# Altium project Mechalino_Second_Layer.PrjPcb
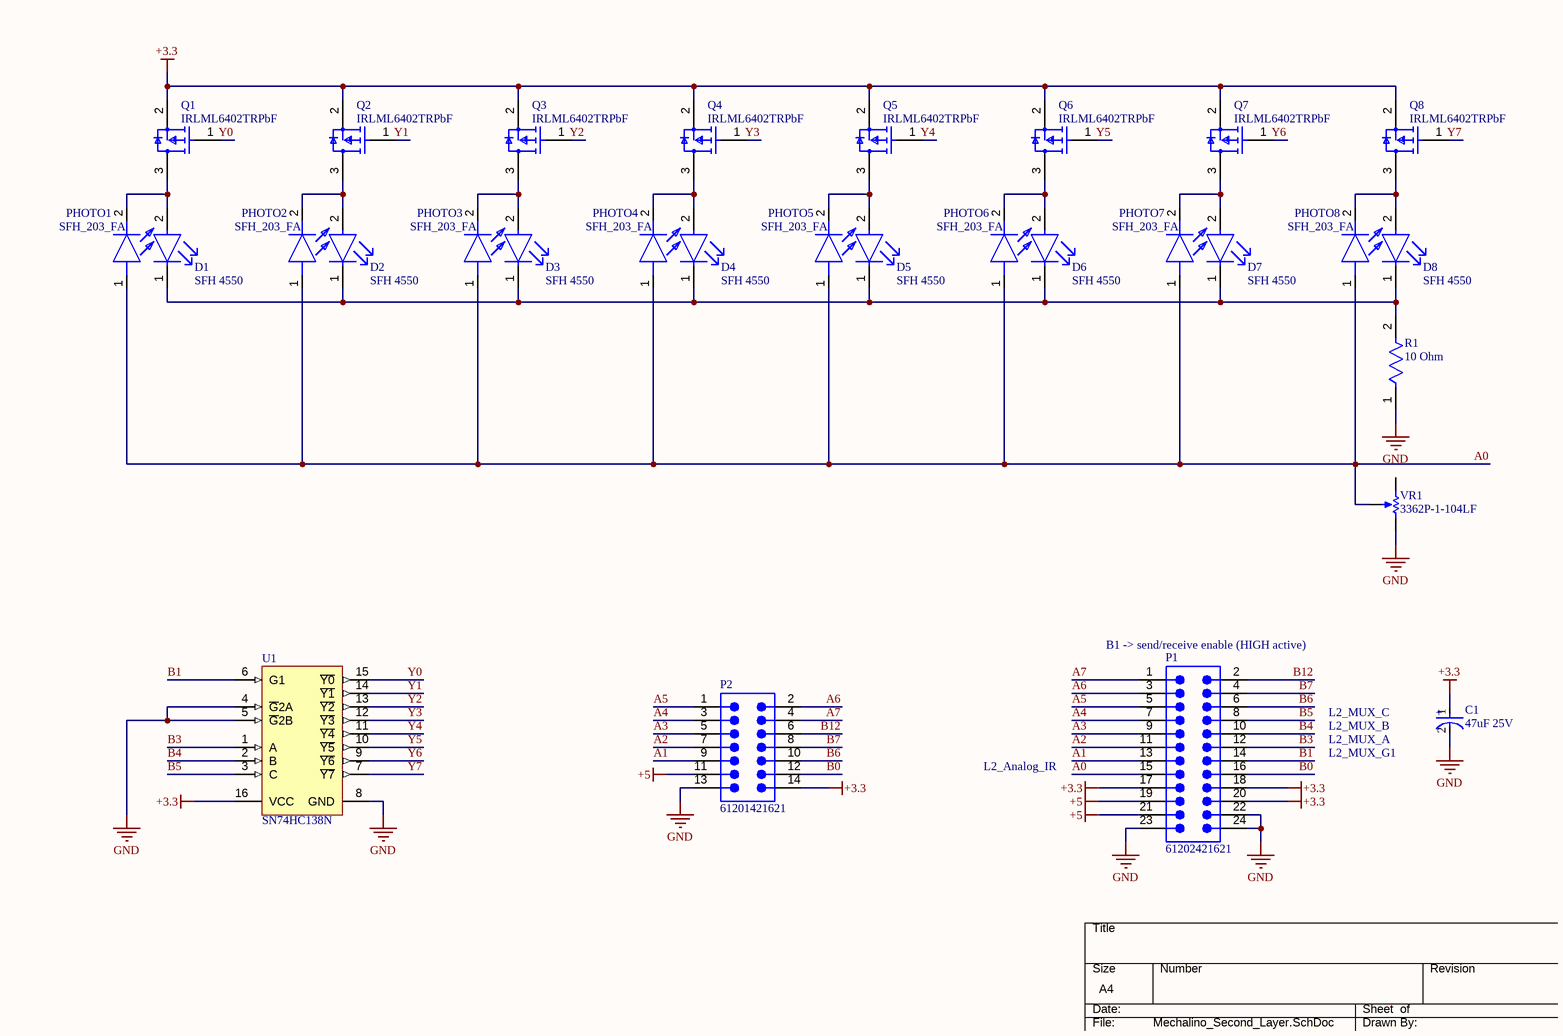
[diagram p0: Mechalino_Second_Layer.SchDoc]
1 sheet, 30 parts. Net scope: global (net labels, ports and power ports of the same name join across sheets).
Board file: Mechalino_Second_Layer.PcbDoc

## Sheet Mechalino_Second_Layer.SchDoc: Mechalino Second Layer
size A4; Author: Luka Kravos; CompanyName: AAU; DrawnBy: Luka Kravos; Engineer: Luka Kravos; Organization: NES, SmartGrids; Address1: Lakeside 10A; Address2: AAU Klagenfurt; SheetNumber: 1; SheetTotal: 1

### Parts
C1  47uF 25V  [FP-FKD-MFG]
D1  SFH 4550  [FP-SFH_4550-MFG]
D2  SFH 4550  [FP-SFH_4550-MFG]
D3  SFH 4550  [FP-SFH_4550-MFG]
D4  SFH 4550  [FP-SFH_4550-MFG]
D5  SFH 4550  [FP-SFH_4550-MFG]
D6  SFH 4550  [FP-SFH_4550-MFG]
D7  SFH 4550  [FP-SFH_4550-MFG]
D8  SFH 4550  [FP-SFH_4550-MFG]
P1  61202421621  [61202421621]
P2  61201421621  [61201421621]
PHOTO1  SFH_203_FA  [SFH203FA]
PHOTO2  SFH_203_FA  [SFH203FA]
PHOTO3  SFH_203_FA  [SFH203FA]
PHOTO4  SFH_203_FA  [SFH203FA]
PHOTO5  SFH_203_FA  [SFH203FA]
PHOTO6  SFH_203_FA  [SFH203FA]
PHOTO7  SFH_203_FA  [SFH203FA]
PHOTO8  SFH_203_FA  [SFH203FA]
Q1  IRLML6402TRPbF  [FP-Micro3-MFG]
Q2  IRLML6402TRPbF  [FP-Micro3-MFG]
Q3  IRLML6402TRPbF  [FP-Micro3-MFG]
Q4  IRLML6402TRPbF  [FP-Micro3-MFG]
Q5  IRLML6402TRPbF  [FP-Micro3-MFG]
Q6  IRLML6402TRPbF  [FP-Micro3-MFG]
Q7  IRLML6402TRPbF  [FP-Micro3-MFG]
Q8  IRLML6402TRPbF  [FP-Micro3-MFG]
R1  10 Ohm  [FP-ESR25-IPC_B]
U1  SN74HC138N  [N0016A]
VR1  3362P-1-104LF  [BOUR-3362P]

### Nets
+3.3: C1.1(C) P1.17 P1.18 P1.20 P2.14 Q1.2(S) Q2.2(S) Q3.2(S) Q4.2(S) Q5.2(S) Q6.2(S) Q7.2(S) Q8.2(S) U1.16(VCC)
+5: P1.19 P1.21 P2.11
GND: C1.2(A) P1.22 P1.23 P1.24 P2.13 R1.1 U1.4(~{G}2A) U1.5(~{G}2B) U1.8(GND) VR1.3(CW)
A0: P1.15 PHOTO1.1(A) PHOTO2.1(A) PHOTO3.1(A) PHOTO4.1(A) PHOTO5.1(A) PHOTO6.1(A) PHOTO7.1(A) PHOTO8.1(A) VR1.2(S)
A1: P1.13 P2.9
A2: P1.11 P2.7
A3: P1.9 P2.5
A4: P1.7 P2.3
A5: P1.5 P2.1
A6: P1.3 P2.2
A7: P1.1 P2.4
B0: P1.16 P2.12
B1: P1.14 U1.6(G1)
B3: P1.12 U1.1(A)
B4: P1.10 U1.2(B)
B5: P1.8 U1.3(C)
B6: P1.6 P2.10
B7: P1.4 P2.8
B12: P1.2 P2.6
Y0: Q1.1(G) U1.15(~{Y0})
Y1: Q2.1(G) U1.14(~{Y1})
Y2: Q3.1(G) U1.13(~{Y2})
Y3: Q4.1(G) U1.12(~{Y3})
Y4: Q5.1(G) U1.11(~{Y4})
Y5: Q6.1(G) U1.10(~{Y5})
Y6: Q7.1(G) U1.9(~{Y6})
Y7: Q8.1(G) U1.7(~{Y7})
NetD1_1: D1.1(C) D2.1(C) D3.1(C) D4.1(C) D5.1(C) D6.1(C) D7.1(C) D8.1(C) R1.2
NetD1_2: D1.2(A) PHOTO1.2(K) Q1.3(D)
NetD2_2: D2.2(A) PHOTO2.2(K) Q2.3(D)
NetD3_2: D3.2(A) PHOTO3.2(K) Q3.3(D)
NetD4_2: D4.2(A) PHOTO4.2(K) Q4.3(D)
NetD5_2: D5.2(A) PHOTO5.2(K) Q5.3(D)
NetD6_2: D6.2(A) PHOTO6.2(K) Q6.3(D)
NetD7_2: D7.2(A) PHOTO7.2(K) Q7.3(D)
NetD8_2: D8.2(A) PHOTO8.2(K) Q8.3(D)

Not connected (* = marked no-connect by the designer): VR1 1(CCW)

### Notes on the sheet
- (near P1) B1 -> send/receive enable (HIGH active)
- L2_MUX_C
- L2_Analog_IR
- L2_MUX_G1
- L2_MUX_A
- L2_MUX_B
- (in symbol CMP-05427-000093-1) +

### Library data of the parts
C1 = CMP-05427-000093-1: CAP ALUM 47UF 20% 25V SMD; Polarity: Polar; Leakage Current: 3uA; Ripple Current: 240mA; Impedance: 360mR; Dielectric Material: Aluminium; Life (Hours): 2000Hour; Capacitance: 47uF; Radiation Hardening: No; Termination: SMD/SMT; Height - Seated (Max): 0.24inch; Diameter: 6.3mm; RoHS Compliant: Yes; Voltage Rating: 25V; Ripple Current (AC): 240mA; Tolerance: 20%; Max Operating Temperature: 105°C; Min Operating Temperature: -55°C; Number of Pins: 2; Voltage: 25V; Height: 5.8mm; Series: FK; Width: 7.8mm; REACH SVHC: No SVHC; Construction: Cylindrical; Mount: Surface Mount; Contact Plating: Tin; Length: 5.8mm; Package Quantity: 1000; ESR (Equivalent Series Resistance): 360mR; Lead Free: Lead Free; Voltage Rating (DC): 25V; Packaging: Tape and Reel; Case/Package: Radial
D1-D8 = CMP-62016-000011-1: EMITTER IR 860NM 100MA RADIAL; Manufacturer: Osram Opto; Forward Voltage: 1.5V; Reverse Voltage: 5V; Viewing Angle: 6°; Led Orientation: Straight; Colour: Infrared; Mouser Description: Infrared Emitters - High Power Infrared 850 nm HALF ANGLE +/-3DEG; RoHS: TRUE; Manufacturer Part Number: SFH 4550; Forward Current: 100mA; Octopart: https://octopart.com/sfh+4550-osram+opto-55410894; ComponentLink2Description: Datasheet; Lead Free: Yes; Temperature: -40°C to +100°C; ComponentLink2URL: https://dammedia.osram.info/media/resource/hires/osram-dam-5580407/SFH%204550_EN.pdf; Device Class L2: LEDs; Temperature Range Low: -40°C; Digikey Description: EMITTER IR 860NM 100MA RADIAL; Temperature Range High: +100°C; Device Class L3: unset; Peak Emmision Wavelength: 860nm; Category: Diode; Package: SFH 4550; Device Class L1: Optoelectronics; Automotive: No
P1 = CMP-1502-00011-2: NexarPartId: 32855474; Pitch: 2.54mm; Number of Positions: 24; Connector Type: Male Pin; Insulation Resistance: 1GΩ; Current Rating: 3A; Contact Resistance: 20mΩ; Operating Supply Voltage: 250V; Gender: Male; Insulation Material: PBT; Row Spacing: 2.54mm; Mount: Through Hole; Number of Pins: 24; Color: Black; Lead Pitch: 2.54mm; RoHS: Compliant; Max Operating Temperature: 105°C; Orientation: Vertical; Contact Material: Copper; Number of Rows: 2; Contact Plating: Gold; REACH SVHC: Unknown; Number of Contacts: 24; Length: 38.14mm; Min Operating Temperature: -40°C; Termination: Solder
P2 = CMP-1502-00008-2: NexarPartId: 26603596; Number of Positions: 14; Connector Type: Male Pin; Voltage Rating: 250V; Insulation Resistance: 1GΩ; Gender: Male; Contact Resistance: 20mΩ; Pitch: 2.54mm; Current Rating: 3A; Insulation Material: PBT; Mount: Through Hole; Number of Rows: 2; Contact Material: Copper; Operating Supply Voltage: 250V; Number of Pins: 14; Min Operating Temperature: -40°C; RoHS: Compliant; REACH SVHC: Unknown; Length: 25.44mm; Contact Plating: Gold; Termination: Solder; Lead Pitch: 2.54mm; Max Operating Temperature: 105°C; Row Spacing: 2.54mm; Height: 9.25mm; Color: Black; Number of Contacts: 14; Orientation: Vertical
PHOTO1-PHOTO8 = SFH_203_FA: PHOTO; Manufacturer_Name: ams OSRAM; Manufacturer_Part_Number: SFH 203 FA; Datasheet Link: https://datasheet.datasheetarchive.com/originals/distributors/DKDS41/DSANUWW0036828.pdf; Height: 8.9mm; Mouser Part Number: 720-SFH203FA; Mouser Price/Stock: https://www.mouser.co.uk/ProductDetail/OSRAM-Opto-Semiconductors/SFH-203-FA?qs=K5ta8V%252BWhtaq1pinUuBcnA%3D%3D
Q1-Q8 = CMP-32901-000130-1: MOSFET P-CH 20V 3.7A SOT-23; Manufacturer: Infineon; Reverse Recovery Time: 29ns; Max Forward Diode Voltage: -1.2V; Input Capacitace At Vds: 633pF @ -10V; Drain To Source Resistance: 0.05Ω; Gate To Source Voltage: 12V; Max Junction Temp: +150°C; Pulse Drain Current: -22A; Threshold Vgs Min: -0.4V; Turn Off Delay Time: 588ns; Number Of Channels: 1; Power Dissipation: 1.3W; Turn On Delay Time: 350ns; Drain To Source Breakdown Voltage: -20V; Continuous Drain Current: -3.7A; Depletion Mode: False; Gate Charge At Vgs: 8nC @ -5V; Rthja Max: 75°C/W; Threshold Vgs: -0.55V; Standoff Height: 0.01mm; Reverse Recovery Charge: 11nC; Device Class L2: Transistors; Ipc Land Pattern Name: SOT95P237X100-3; Temperature Range High: +150°C; Octopart: https://octopart.com/irlml6402trpbf-infineon-65874989; ComponentLink2URL: https://www.infineon.com/dgdl/irlml6402pbf.pdf?fileId=5546d462533600a401535668d5c2263c; Automotive: No; Manufacturer Part Number: IRLML6402TRPBF; Height: 1.12mm; Drain To Source Voltage: -20V; Digikey Description: MOSFET P-CH 20V 3.7A SOT-23; Device Class L1: Discrete Semiconductors; Package: Micro3; Lead Free: Yes; Temperature Range Low: -55°C; Number Of P Channels: 1; Technology: MOSFET; Temperature: -55°C to +150°C; Category: Trans; Footprint Url: http://irf.com/package/outline/po_micro3.pdf; RoHS: TRUE; Device Class L3: MOSFETs; Threshold Vgs Max: -1.2V; ComponentLink2Description: Datasheet
R1 = CMP-08839-008971-1: 10Ω ±5% 0.66W 1210 Anti-Surge Chip Resistor AEC-Q200; Temperature Coefficient: 200ppm/°C; Resistance: 10R; Max Power Dissipation: 500mW; Length: 0.126inch; Series: ESR; Tolerance: 5%; Min Operating Temperature: -55°C; Height: 0.026inch; Number of Terminations: 2; Case Code (Imperial): 1210; RoHS Compliant: Yes; Width: 0.098inch; Resistor Type: Thick Film; Features: Automotive AEC-Q200; Packaging: Tape and Reel; Package Quantity: 1; Case/Package: 1210; Case Code (Metric): 3225; Max Operating Temperature: 155°C
U1 = CMP-1633-00627-2: 3-Line To 8-Line Decoders/Demultiplexers, N0016A, TUBE; Manufacturer: Texas Instruments; Bits(#): 8; Function: Decoder/Demultiplexer; F @ Nom Voltage(Max)(Mhz): 28; Input Type: LVTTL/CMOS; VCC(Min)(V): 2; VCC(Max)(V): 6; Technology Family: HC; Rating: Catalog; Schmitt Trigger: No; Voltage(Nom)(V): 3.3,5; Output Type: CMOS; Channels(#): 1; Output Drive (IOL/IOH)(Max)(mA): 5.2/-5.2; ICC @ Nom Voltage(Max)(mA): 0.08; tpd @ Nom Voltage(Max)(ns): 45; Configuration: 3：8; DatasheetVersion: SCLS107E; Type: Standard; PackageReference: N0016A; Generic Part Number: SN74HC138; Code_JEDEC: MS-001; Operating Temperature Range(C): -40 to 85
VR1 = CMP-1747-00003-1: Square Trimpot(R) Trimming Potentiometer, 100 KOhm, 300 V, -55 to 125 degC, 3-Pin THD, RoHS, Tube; Voltage Rating: 250 V; Case\Package: Axial; Tolerance: 1%; Power Rating: 250 mW; Resistance: 1 mohm; RoHSCompliant: true; ComponentLink2URL: http://www.bourns.com/docs/Product-Datasheets/3362.pdf; ComponentLink1Description: Manufacturer URL; DatasheetVersion: May-16; Package Quantity: 200; ComponentLink2Description: Datasheet; Min Operating Temperature: -55 degC; Mount: Through Hole; PackageDescription: 3-Pin Through Hole Device, Body 6.6 x 6.99 mm, Pitch 2.54 mm; Length: 0.248 inch; ComponentLink1URL: http://www.bourns.com/; PackageReference: 3326P; Max Operating Temperature: 155 degC; Packaging: Bulk